# Altium schematic sheet MainPowerSupply.SchDoc: Main power supply
size A4; Author: Luís Henrique DAvila Possatti; Organization: UNICAMP / LCEE; Address1: University of Campinas - Brazil; Address2: Power Conditioning Laboratory; Address3: Licensed by GNU GPL 3.0; ProjectName: Easy Inverter
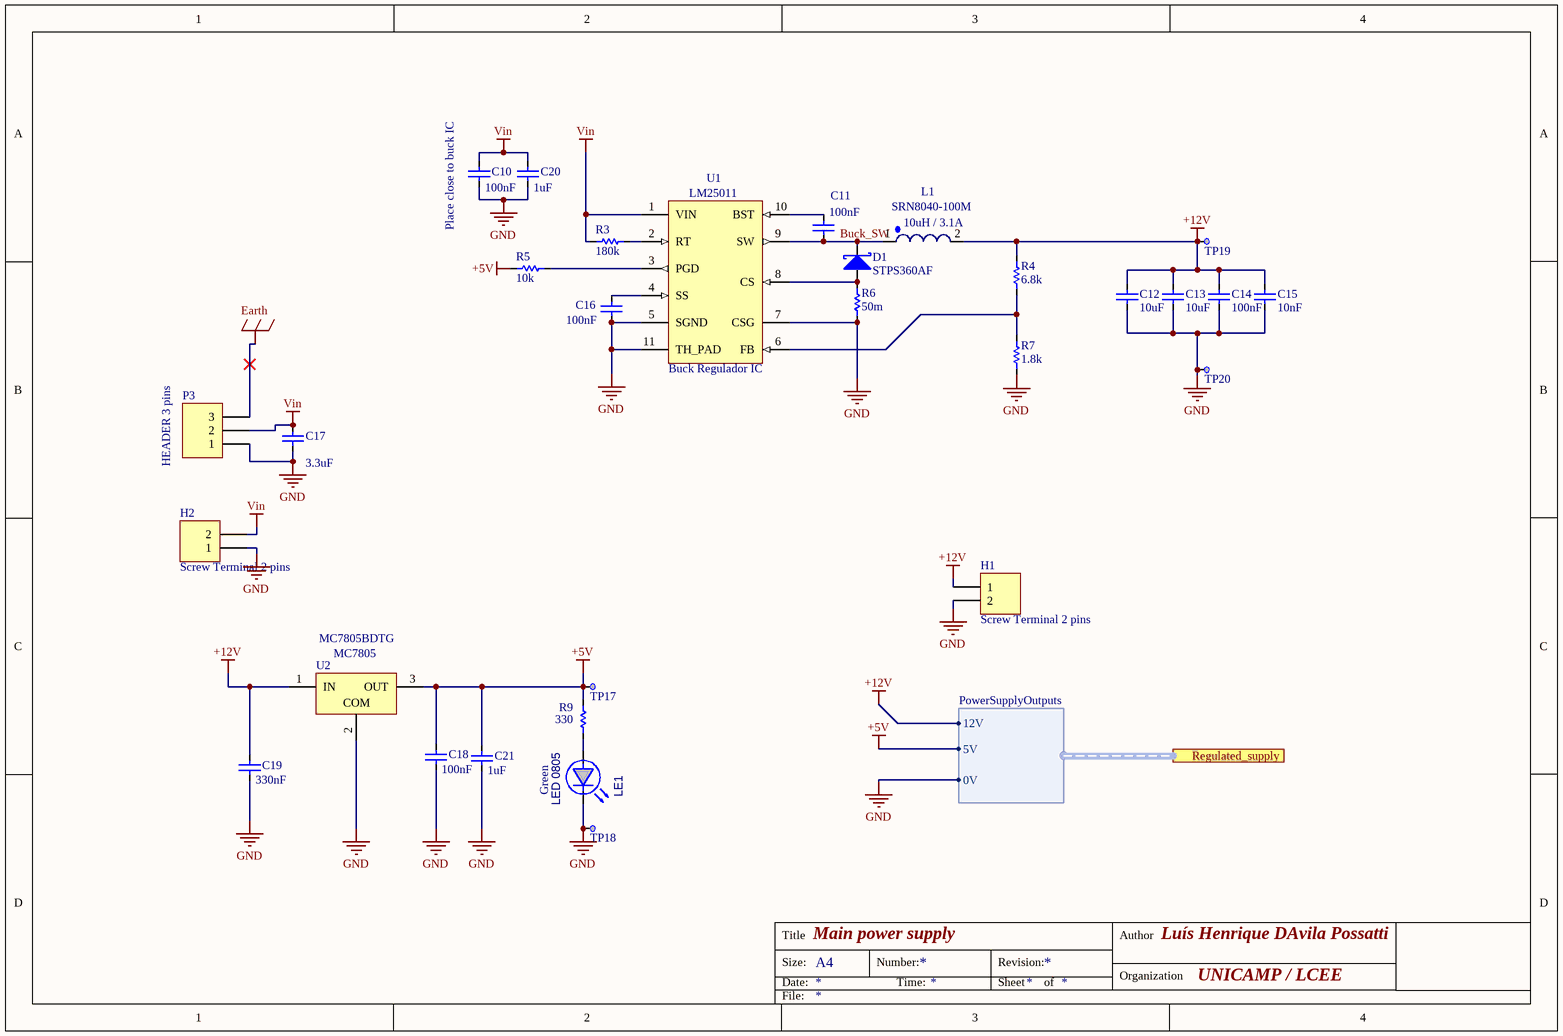
[diagram p0: MainPowerSupply.SchDoc]

## Parts
C10  Place close to buck IC  value 100nF  [Capacitor 0805]
C11  value 100nF  [Capacitor 0805]  (hidden comment: Capacitor 0805)
C12  value 10uF  [Capacitor 0805]  (hidden comment: Capacitor 0805)
C13  value 10uF  [Capacitor 0805]  (hidden comment: Capacitor 0805)
C14  value 100nF  [Capacitor 0805]  (hidden comment: Capacitor 0805)
C15  value 10nF  [Capacitor 0805]  (hidden comment: Capacitor 0805)
C16  value 100nF  [Capacitor 0805]  (hidden comment: Capacitor 0805)
C17  value 3.3uF  [Capacitor 0805]  (hidden comment: Place close to input)
C18  value 100nF  [Capacitor 0805]  (hidden comment: Place close do MC7805)
C19  value 330nF  [Capacitor 0805]  (hidden comment: Place close do MC7805)
C20  value 1uF  [Capacitor 0805]  (hidden comment: Place close to buck IC)
C21  value 1uF  [Capacitor 0805]  (hidden comment: Place close do MC7805)
D1  STPS360AF  [SOD 128]
H1  Screw Terminal 2 pins  [OSTTA020161]
H2  Screw Terminal 2 pins  [OSTTA020161]
L1  SRN8040-100M  value 10uH / 3.1A  [SRN8040]
LE1  value LED 0805  Color: Green  [LED 0805 Green]  (hidden comment: LEDSMD 0805)
P3  HEADER 3 pins  [HDR1X3]
R3  value 180k  [Resistor 0805]  (hidden comment: Resistor 0805)
R4  value 6.8k  [Resistor 0805]  (hidden comment: Resistor 0805)
R5  value 10k  [Resistor 0805]  (hidden comment: Resistor 0805)
R6  value 50m  [Resistor 0805]  (hidden comment: MCS1632R050FER)
R7  value 1.8k  [Resistor 0805]  (hidden comment: Resistor 0805)
R9  value 330  [Resistor 0805]  (hidden comment: Resistor 0805)
TP17  Name of signal  [Test point]  (value not drawn)  (no BOM)
TP18  Name of signal  [Test point]  (value not drawn)  (no BOM)
TP19  Name of signal  [Test point]  (value not drawn)  (no BOM)
TP20  Name of signal  [Test point]  (value not drawn)  (no BOM)
U1  Buck Regulador IC  value LM25011  [HVSSOP 10]
U2  MC7805BDTG  value MC7805  [DPAK-3]

## Ports
Regulated_supply (harness PowerSupplyOutputs)

## Harnesses
PowerSupplyOutputs: 12V, 5V, 0V

## Nets
+5V: C18.1 C21.1 R5.1 R9.2 TP17.1 U2.3(OUT) ; port Regulated_supply.5V
+12V: C12.1 C13.1 C14.1 C15.1 C19.1 H1.1 L1.2 R4.2 TP19.1 U2.1(IN) ; port Regulated_supply.12V
Earth: P3.3
GND: C10.2 C12.2 C13.2 C14.2 C15.2 C16.2 C17.2 C18.2 C19.2 C20.2 C21.2 H1.2 H2.1 LE1.2 P3.1 R6.1 R7.1 TP18.1 TP20.1 U1.5(SGND) U1.7(CSG) U1.11(TH_PAD) U2.2(COM) ; port Regulated_supply.0V
Vin: C10.1 C17.1 C20.1 H2.2 P3.2 R3.1 U1.1(VIN)
Buck_SW: C11.2 D1.2(K) L1.1 U1.9(SW)
NetC11_1: C11.1 U1.10(BST)
NetC16_1: C16.1 U1.4(SS)
NetD1_1: D1.1(A) R6.2 U1.8(CS)
NetLE1_1: LE1.1 R9.1
NetR3_2: R3.2 U1.2(RT)
NetR4_1: R4.1 R7.2 U1.6(FB)
NetR5_2: R5.2 U1.3(PGD)

## Notes on the sheet
- Title
- Size:
- Date:
- A4
- Number:
- Time:
- Revision:
- Sheet
- of
- Author
- Organization
- File:

## Library data of the parts
C10-C21 = Capacitor 0805: SMD ceramic capacitor 0805; pn: undefined
  C10 C20: ClassName: Buck_circuit, direct_plane_connect
  C11 C16: ClassName: Buck_circuit
  C12-C15: ClassName: Buck_circuit, strong_connection
  C17: ClassName: direct_plane_connect
  C18 C19 C21: ClassName: strong_connection
D1 = STPS360AF: DIODE SCHOTTKY 60V 3A SOD128; pn: STPS360AF; ComponentLink1Description: Datasheet; ComponentLink1URL: http://www.st.com/content/ccc/resource/technical/document/datasheet/group3/06/00/c2/7f/e8/20/4a/81/DM00306268/files/DM00306268.pdf/jcr:content/translations/en.DM00306268.pdf; ClassName: Buck_circuit
H1 H2 = OSTTA020161: Value: Two wire screw terminal; pn: OSTTA020161; ClassName: strong_connection
L1 = SRN8040-100M: Inductor 10UH 3.1A 50 mΩ SMD; pn: SRN8040-100M; ComponentLink2Description: Datasheet; ComponentLink2URL: http://www.we-online.de/katalog/media/pdf/744862180.pdf; ClassName: Buck_circuit, strong_connection
P3 = HEADER 3 pins: Header 2.54mm 3 pins; PN: ?
R3-R5 R7 R9 = Resistor 0805: SMD resistor 0805; pn: undefined
  R3-R5 R7: ClassName: Buck_circuit
R6 = MCS1632R050FER: RESISTOR 0.05 OHM 1% 1W SMD 1206; pn: MCS1632R050FER; ClassName: Buck_circuit, strong_connection
TP17 = Test point: Test point to probe with oscilloscope; Signal_name: 5V; ClassName: Direct_plane_connect
TP18 TP20 = Test point: Test point to probe with oscilloscope; Signal_name: GND; ClassName: Direct_plane_connect
TP19 = Test point: Test point to probe with oscilloscope; Signal_name: 12V; ClassName: Direct_plane_connect
U1 = LM25011: IC REG BUCK ADJ 2A 10MSOP; pn: LM25011MYX/NOPB; ComponentLink1Description: Datasheet; ComponentLink1URL: http://www.ti.com/lit/ds/symlink/lm25011.pdf; ClassName: Buck_circuit
U2 = MC7805BDTG: IC REG LINEAR 5V 1A DPAK-3; pn: MC7805BDTG; ComponentLink1Description: Datasheet; ComponentLink1URL: http://www.onsemi.com/pub/Collateral/MC7800-D.PDF; ClassName: strong_connection